# EAGLE design hbridge_DRV8432 (EAGLE 7.3.0)
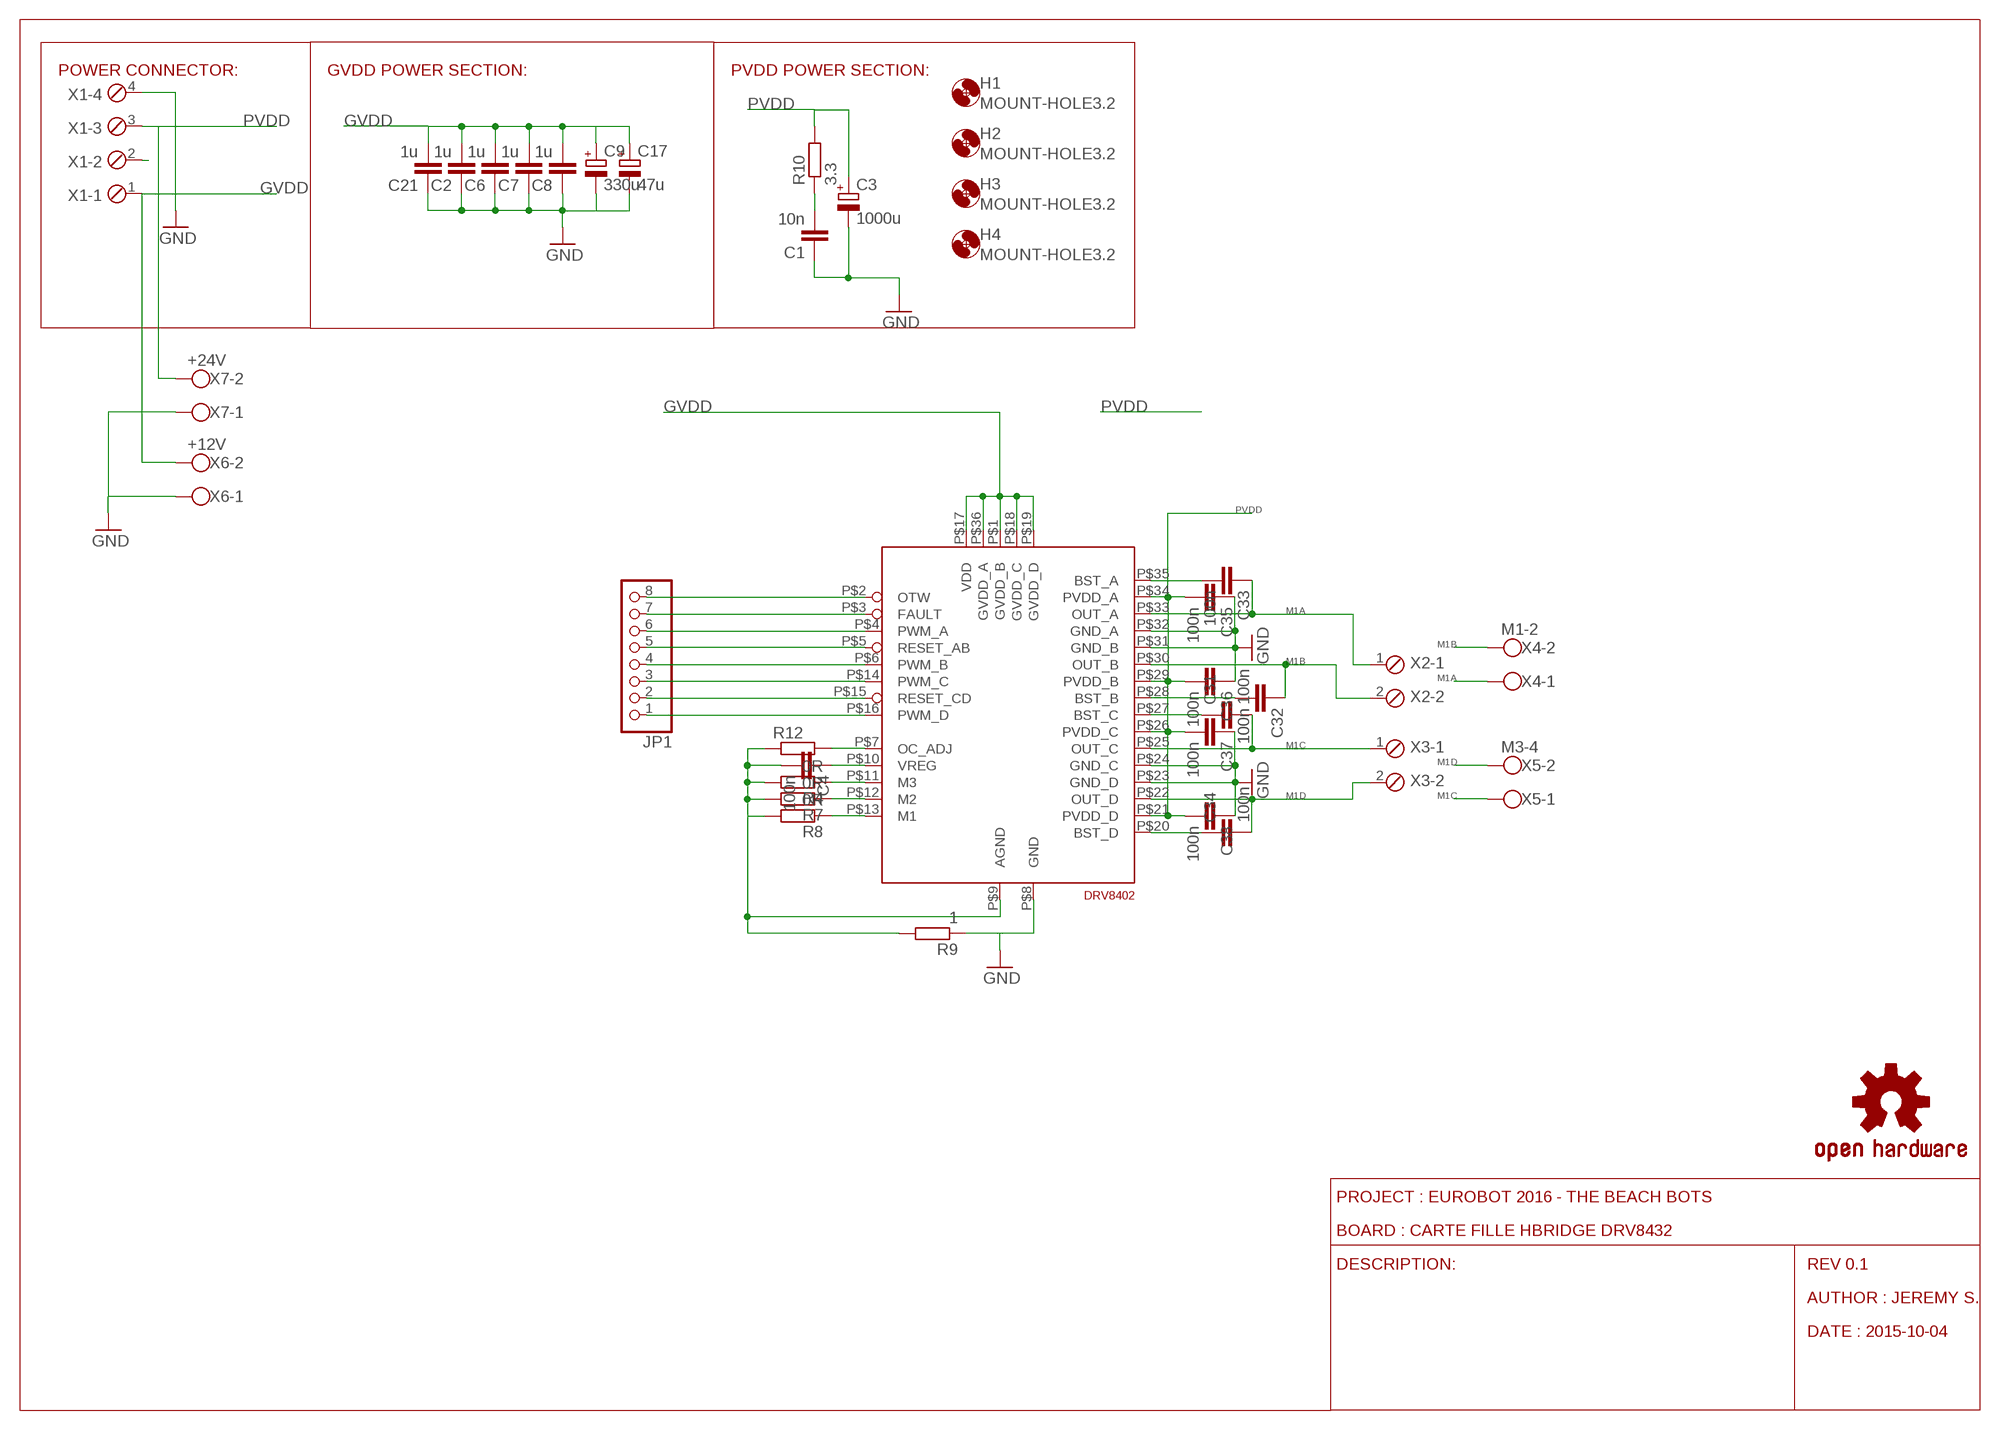
[diagram p0: schematic, sheet 1]

## Parts
C1  10n  C-EUC0805  [C0805]
C2  1u  C-EUC0805  [C0805]
C3  1000u  CPOL-EUE3.5-10  [E3,5-10]
C4  100n  C-EUC0603K  [C0603K]
C6  1u  C-EUC0805  [C0805]
C7  1u  C-EUC0805  [C0805]
C8  1u  C-EUC0805  [C0805]
C9  330u  CPOL-EUB/3528-21W  [B/3528-21W]
C17  47u  CPOL-EUB/3528-21W  [B/3528-21W]
C21  1u  C-EUC0805  [C0805]
C31  100n  C-EUC0805  [C0805]
C32  100n  C-EUC0805  [C0805]
C33  100n  C-EUC0805  [C0805]
C34  100n  C-EUC0805  [C0805]
C35  100n  C-EUC0603  [C0603]
C36  100n  C-EUC0603  [C0603]
C37  100n  C-EUC0603  [C0603]
C38  100n  C-EUC0603  [C0603]
H1  MOUNT-HOLE3.2  [3,2]
H2  MOUNT-HOLE3.2  [3,2]
H3  MOUNT-HOLE3.2  [3,2]
H4  MOUNT-HOLE3.2  [3,2]
IC1  DRV8402  [DRV8402]
JP1  PINHD-1X08_2.54  [1X08]
R4  0R  R-EU_R0603  [R0603]
R7  0R  R-EU_R0603  [R0603]
R8  0R  R-EU_R0603  [R0603]
R9  1  R-EU_R0603  [R0603]
R10  3.3  R-EU_R1206  [R1206]
R12  R-EU_R0603  [R0603]
U$1  OSHW-LOGOS  [OSHW-LOGO-S]
X1  MPT4  [4POL254]
X2  MPT2  [2POL254]
X3  MPT2  [2POL254]
X4  M1-2  W237-102  [W237-102]
X5  M3-4  W237-102  [W237-102]
X6  +12V  W237-102  [W237-102]
X7  +24V  W237-102  [W237-102]

## Nets
GND: C1.1 C2.1 C3.- C6.1 C7.1 C8.1 C9.- C17.- C21.1 C35.1 C36.1 C37.1 C38.1 IC1.P$8(GND) IC1.P$23(GND_D) IC1.P$24(GND_C) IC1.P$31(GND_B) IC1.P$32(GND_A) R9.1 X1.4 X6.1 X7.1
GVDD: C2.2 C6.2 C7.2 C8.2 C9.+ C17.+ C21.2 IC1.P$1(GVDD_B) IC1.P$17(VDD) IC1.P$18(GVDD_C) IC1.P$19(GVDD_D) IC1.P$36(GVDD_A) X1.1 X6.2
M1A: C33.1 IC1.P$33(OUT_A) X2.1 X4.1
M1B: C32.1 IC1.P$30(OUT_B) X2.2 X4.2
M1C: C31.2 IC1.P$25(OUT_C) X3.1 X5.1
M1D: C34.2 IC1.P$22(OUT_D) X3.2 X5.2
N$1: IC1.P$2(OTW) JP1.8
N$3: IC1.P$13(M1) R8.1
N$4: IC1.P$12(M2) R7.1
N$5: IC1.P$11(M3) R4.1
N$6: IC1.P$3(FAULT) JP1.7
N$8: IC1.P$4(PWM_A) JP1.6
N$9: C4.2 IC1.P$9(AGND) R4.2 R7.2 R8.2 R9.2 R12.1
N$10: IC1.P$7(OC_ADJ) R12.2
N$11: C4.1 IC1.P$10(VREG)
N$12: X1.2
N$13: C1.2 R10.1
N$16: IC1.P$5(RESET_AB) JP1.5
N$17: IC1.P$6(PWM_B) JP1.4
N$18: IC1.P$14(PWM_C) JP1.3
N$19: IC1.P$15(RESET_CD) JP1.2
N$20: IC1.P$16(PWM_D) JP1.1
N$25: C33.2 IC1.P$35(BST_A)
N$26: C32.2 IC1.P$28(BST_B)
N$27: C31.1 IC1.P$27(BST_C)
N$28: C34.1 IC1.P$20(BST_D)
PVDD: C3.+ C35.2 C36.2 C37.2 C38.2 IC1.P$21(PVDD_D) IC1.P$26(PVDD_C) IC1.P$29(PVDD_B) IC1.P$34(PVDD_A) R10.2 X1.3 X7.2

## Notes on the sheet
- POWER CONNECTOR: | GVDD POWER SECTION: | PVDD POWER SECTION:
- PROJECT : EUROBOT 2016 - THE BEACH BOTS
- BOARD : CARTE FILLE HBRIDGE DRV8432
- DESCRIPTION: | REV 0.1
- AUTHOR : JEREMY S.
- DATE : 2015-10-04

## Library data of the parts
C1 C2 C4 C6-C8 C21 C31-C38 = rcl:C-EU: CAPACITOR, European symbol
C3 C9 C17 = rcl:CPOL-EU: POLARIZED CAPACITOR, European symbol
H1-H4 = holes:MOUNT-HOLE: MOUNTING HOLE with drill center marker
IC1 = etienne:DRV8402
JP1 = pinhead-2:PINHD-1X08: PIN HEADER
R4 R7 R8 = resistor:R-EU_: RESISTOR, European symbol
R9 R10 R12 = rcl:R-EU_: RESISTOR, European symbol
U$1 = SparkFun-Aesthetics:OSHW-LOGO: Open Source Hardware Logo This logo indicates the piece of hardware it is found on incorporates a OSHW license and/or adheres to the definition of open source hardware found here: http://freedomdefined.org/OSHW
X1 = con-phoenix-254:MPT4: PHOENIX CONNECTOR; OC_FARNELL: unknown; OC_NEWARK: unknown
X2 X3 = con-phoenix-254:MPT2: PHOENIX CONNECTOR; OC_FARNELL: unknown; OC_NEWARK: unknown
X4-X7 = con-wago-500:W237-102: WAGO SCREW CLAMP

## Board
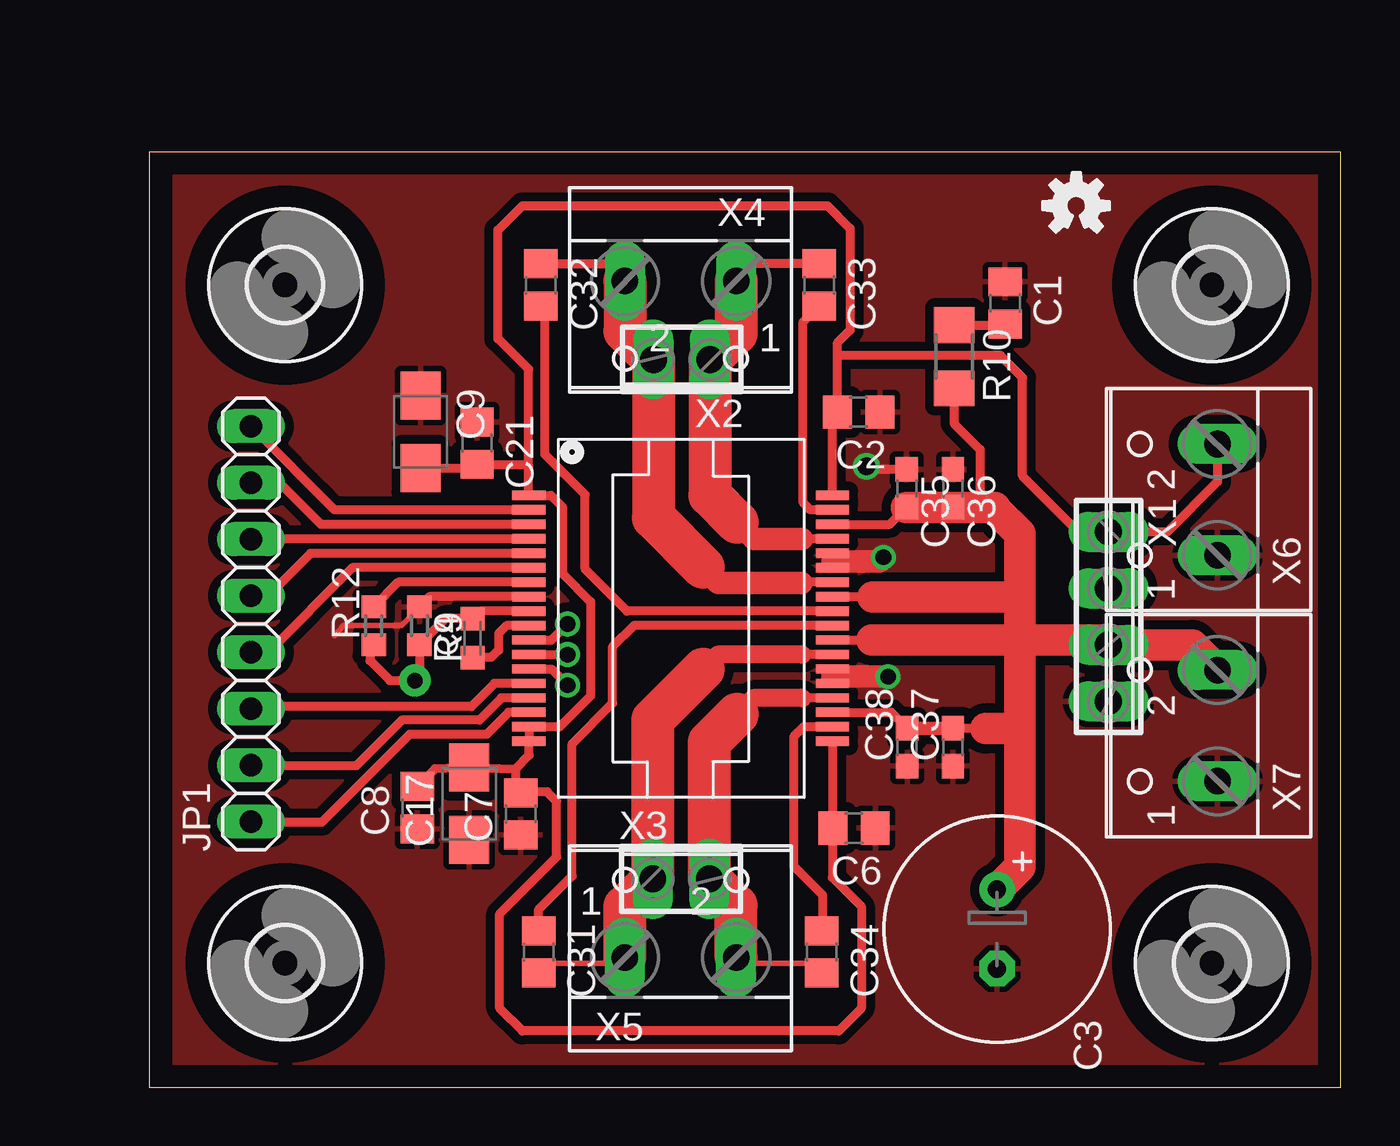
[diagram p1: board, top side]
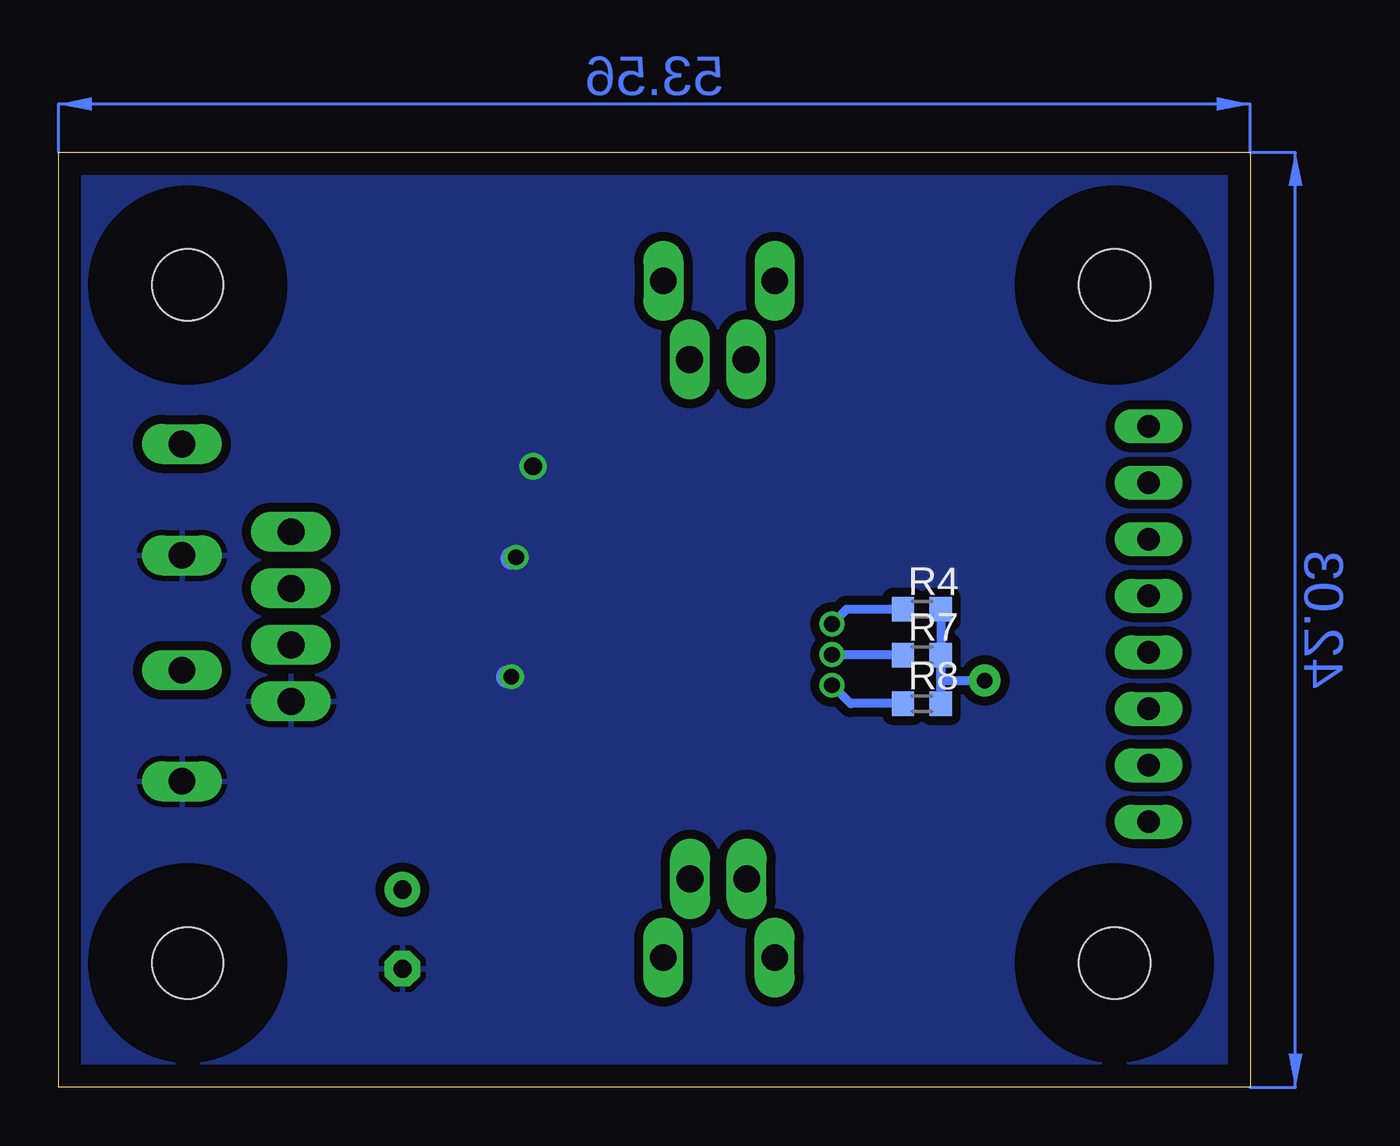
[diagram p2: board, bottom side, seen from below]

Size 53.56 x 42.03 mm. Coordinates in mm from the lower left corner, seen from the top.
Outline: 0,0 53.56,0 53.56,42.03 0,42.03 0,0
Copper layers (1*16): Top 0.035mm / dielectric 1.5mm / Bottom 0.035mm
Design rules "default": minimum track width 10mil, minimum drill 24mil, track to track 8mil, track to pad 8mil, pad to pad 8mil, via to via 8mil, smd to smd 8mil, copper to edge 40mil, drill to drill 8mil, minimum pad ring 10mil, minimum via ring 8mil, stop-mask expansion 4mil, vias tented up to drill 0mil, thermal gap 10mil

### Footprints (pad centres in the part's own frame; a part is rotated, then mirrored left to right if it is on the bottom)
C0805 = smd 1.3 x 1.5: 1 -0.95,0; 2 0.95,0
E3,5-10 = drill 0.813 pad 1.6: + -1.778,0 | drill 0.813 pad 1.6 octagon: - 1.778,0
C0603K = smd 1.05 x 1.08: 1 -0.875,0; 2 0.875,0
B/3528-21W = smd 2.15 x 1.8: + 1.625,0; - -1.625,0
C0603 = smd 1.1 x 1: 1 -0.85,0; 2 0.85,0
3,2 = hole 3.2: 0,0
DRV8402 = smd 0.42 x 1.5: P$1 -5.525,-6.825; P$2 -4.875,-6.825; P$3 -4.225,-6.825; P$4 -3.575,-6.825; P$5 -2.925,-6.825; P$6 -2.275,-6.825; P$7 -1.625,-6.825; P$8 -0.975,-6.825; P$9 -0.325,-6.825; P$10 0.325,-6.825; P$11 0.975,-6.825; P$12 1.625,-6.825; P$13 2.275,-6.825; P$14 2.925,-6.825; P$15 3.575,-6.825; P$16 4.225,-6.825; P$17 4.875,-6.825; P$18 5.525,-6.825; P$19 5.525,6.825; P$20 4.875,6.825; P$21 4.225,6.825; P$22 3.575,6.825; P$23 2.925,6.825; P$24 2.275,6.825; P$25 1.625,6.825; P$26 0.975,6.825; P$27 0.325,6.825; P$28 -0.325,6.825; P$29 -0.975,6.825; P$30 -1.625,6.825; P$31 -2.275,6.825; P$32 -2.925,6.825; P$33 -3.575,6.825; P$34 -4.225,6.825; P$35 -4.875,6.825; P$36 -5.525,6.825
1X08 = drill 1.016 long: 1 -8.89,0; 2 -6.35,0; 3 -3.81,0; 4 -1.27,0; 5 1.27,0; 6 3.81,0; 7 6.35,0; 8 8.89,0
R0603 = smd 1 x 1.1: 1 -0.85,0; 2 0.85,0
R1206 = smd 1.6 x 1.803: 1 -1.422,0; 2 1.422,0
4POL254 = drill 1.2 long: 1 -3.81,0; 2 -1.27,0; 3 1.27,0; 4 3.81,0
2POL254 = drill 1.2 long: 1 -1.27,0; 2 1.27,0
W237-102 = drill 1.194 long: 1 -2.5,-1.27; 2 2.5,-1.27

### Placement (x,y rotation side)
C1  38.46,35.26 270 top
C2  31.88,30.35 180 top
C3  38.1,7.11 270 top
C4  14.53,20.19 90 top
C6  31.67,11.66 180 top
C7  16.69,12.29 90 top
C8  12.04,12.57 90 top
C9  12.19,29.46 270 top
C17  14.38,12.75 90 top
C21  14.73,28.96 270 top
C31  17.5,6.1 270 top
C32  17.6,36.07 270 top
C33  30.1,36.07 270 top
C34  30.23,6.1 270 top
C35  34.04,26.92 270 top
C36  36.12,26.92 270 top
C37  36.12,15.29 90 top
C38  34.06,15.29 90 top
H1  6.1,5.59 0 top
H2  47.75,5.59 0 top
H3  6.1,36.07 0 top
H4  47.75,36.07 0 top
IC1  23.88,21.08 270 top
JP1  4.57,20.83 90 top
R4  14.76,21.49 0 bottom
R7  14.76,19.43 0 bottom
R8  14.76,17.25 0 bottom
R9  12.14,20.75 270 top
R10  36.17,32.84 270 top
R12  10.08,20.75 90 top
U$1  41.66,39.62 0 top
X1  43.1,21.16 270 top
X2  23.93,32.72 180 top
X3  23.9,9.37 0 top
X4  23.88,34.98 180 top
X5  23.88,7.11 0 top
X6  46.74,26.42 90 top
X7  46.74,16.26 90 top

### Tracks (layer width: path | path; a pad name or v marks a point on that pad's centre or on a via)
GND  (via drill 0.7 pad 1.02, 0.8 pad 1.02)
  Top 0.254: 12.15,21.55 11.33,20.75 8.74,20.75 8.33,20.32
  Top 0.305: 12.15,21.59 12.15,21.55 11.9,21.55
  Top 0.406: IC1.P$8 12.6,22.06 R9.1 | IC1.P$23 IC1.P$24 30.7,18.47 30.71,18.47 | IC1.P$31 IC1.P$32 30.7,23.66 30.71,23.65 | C35.1 32.58,27.77 v32.23,27.91
  Top 1.016: 30.71,18.47 v33.2,18.47 | 30.71,23.65 32.82,23.65 v33,23.82
  Bottom 0.406: v32.23,27.91 32.23,28.12
  Bottom 1.016: v33.2,18.47 33.38,18.47 33.4,18.44 | v33,23.82 33.15,23.82 33.2,23.77
  pour Bottom (isolate 0.406): 1.02,42.16 53.85,42.16 53.85,32.51 53.85,0 1.02,0
  pour Top (isolate 0.406): 1.02,42.16 1.02,0 53.85,0 53.85,42.16
GVDD
  Top 0.406: 16.46,14.32 C17.+ 12.84,14.32 C8.2 | 16.46,14.32 17.07,14.93 17.07,15.57 | IC1.P$17 17.07,16.19 17.07,15.57 | 16.46,14.32 16.46,13.68 C7.2 16.73,13.28 17.88,13.28 18.31,12.85 18.31,10.36 15.75,7.8 15.75,3.56 16.76,2.54 30.99,2.54 32,3.56 32,8.13 30.7,9.43 30.7,11.68 | 17.05,27.94 IC1.P$1 18.05,26.61 18.57,26.09 18.57,23.09 19.84,21.82 19.84,17.6 18.44,16.2 IC1.P$17 | 17.05,27.94 17.05,32.28 15.67,33.66 15.67,38.53 16.76,39.62 30.48,39.62 31.5,38.61 31.5,34.04 30.93,33.47 30.93,33.02 | IC1.P$36 30.7,30.07 C2.2 30.93,33.02 | 17.05,27.94 16.98,28.01 C21.2 14.56,27.84 C9.+ | IC1.P$19 30.7,11.68 | 30.7,11.68 C6.2 | 30.93,33.02 31.05,32.89 38.25,32.89 39.24,31.9 39.24,27.48 41.76,24.97 X1.1 45.75,24.97 48.01,27.23 X6.2 | IC1.P$17 | 17.07,15.57 IC1.P$18
M1A
  Top 0.406: C33.1 27.15,37.02 X4.1 | IC1.P$33 29.34,24.66 29.34,24.64
  Top 0.61: 28.96,24.64 29.03,24.61 29.01,24.59
  Top 1.016: 29.34,24.64 28.96,24.64 27.18,24.64 26.42,25.4
  Top 1.93: X4.1 26.38,33.89 X2.1 25.2,26.62 26.42,25.4
M1B
  Top 0.406: C32.1 20.6,37.02 X4.2 | 28.98,22.71 29.31,22.68 | IC1.P$30 28.96,22.71 28.96,22.68
  Top 1.016: 29.31,22.68 28.96,22.68 25.58,22.68 24.89,23.37
  Top 1.93: X4.2 21.38,34 X2.2 22.66,25.6 24.89,23.37
M1C
  Top 0.254: 20.68,5.15 21.34,5.15 21.34,5.59 17.5,5.59 C31.2
  Top 0.406: 20.68,5.15 X5.1 | IC1.P$25 28.98,19.46 29.34,19.46
  Top 0.813: 29.34,19.46 25.55,19.46 24.89,18.8
  Top 1.93: X5.1 21.38,8.12 X3.1 22.63,16.54 24.89,18.8
M1D
  Top 0.254: 27.07,5.15 26.42,5.15 26.42,5.59 30.23,5.59 C34.2
  Top 0.406: 27.07,5.15 X5.2 | IC1.P$22 28.99,17.51 29.34,17.5
  Top 0.813: 29.34,17.5 27.15,17.5 26.42,16.76
  Top 1.93: X5.2 26.38,8.17 X3.2 25.17,15.52 26.42,16.76
N$1
  Top 0.406: IC1.P$2 8.33,25.96 JP1.8
N$3  (via drill 0.7 pad 0.41)
  Top 0.406: IC1.P$13 18.07,18.81 v18.8,18.09
  Bottom 0.406: R8.1 17.96,17.25 v18.8,18.09
N$4  (via drill 0.7 pad 0.41)
  Top 0.406: IC1.P$12 18.82,19.46 v18.8,19.46
  Bottom 0.406: R7.1 18.77,19.43 v18.8,19.46
N$5  (via drill 0.7 pad 0.41)
  Top 0.406: IC1.P$11 18.07,20.11 v18.8,20.83
  Bottom 0.406: R4.1 18.14,21.49 v18.8,20.83
N$6
  Top 0.406: JP1.7 5.84,27.18 7.71,25.31 IC1.P$3
N$8
  Top 0.406: IC1.P$4 4.59,24.66 JP1.6
N$9  (via drill 0.7 pad 1.42)
  Top 0.406: R12.1 9.92,19.9 9.92,19.19 10.82,18.29 v11.94,18.29 12.14,18.49 R9.2 13.31,21.07 C4.2 14.87,21.41 IC1.P$9
  Bottom 0.406: R8.2 13.91,18.29 | 13.91,18.29 R7.2 R4.2 13.91,18.48 | 13.91,18.29 v11.94,18.29
N$10
  Top 0.406: IC1.P$7 11.19,22.71 R12.2
N$11
  Top 0.406: IC1.P$10 16.06,20.76 15.7,20.4 15.7,19.66 15.37,19.33 14.54,19.33 C4.1
N$13
  Top 0.406: R10.1 38.98,34.26 C1.2
N$16
  Top 0.406: JP1.5 5.33,22.1 7.24,24.01 IC1.P$5
N$17
  Top 0.406: JP1.4 5.33,19.56 9.13,23.36 IC1.P$6
N$18
  Top 0.406: IC1.P$14 15.52,18.16 14.48,17.12 4.67,17.12 JP1.3 4.6,16.99
N$19
  Top 0.406: IC1.P$15 15.83,17.51 14.83,16.51 11.35,16.51 9.3,14.45 4.6,14.45 JP1.2
N$20
  Top 0.406: IC1.P$16 16.15,16.86 15.16,15.88 11.71,15.88 7.75,11.91 4.6,11.91 JP1.1
N$25
  Top 0.406: IC1.P$35 29.72,25.96 29.39,26.29 29.39,34.41 C33.2
N$26
  Top 0.406: 17.22,35.07 C32.2 17.78,34.61 17.78,28.45 18.29,27.94 18.59,27.64 19.58,26.64 19.58,23.29 21.47,21.41 IC1.P$28
N$27
  Top 0.406: IC1.P$27 21.77,20.76 20.83,19.81 20.83,17.27 19,15.44 19,9.5 17.5,8 C31.1
N$28
  Top 0.406: IC1.P$20 29.41,16.21 28.96,15.75 28.96,9.96 30.25,8.66 30.25,7.07 C34.1
PVDD
  Top 0.406: IC1.P$34 33.27,25.31 C35.2 C36.2 37.5,26.07 37.34,26.24 37.34,28.68 36.17,29.85 R10.2 | IC1.P$21 33.34,16.86 C38.2 | IC1.P$26 32.49,20.11 32.49,20.09 | IC1.P$29 32.51,22.06 32.51,22.05 | 37.59,16.13 36.12,16.13 C37.2
  Top 0.61: C37.2 C38.2 | R10.2
  Top 1.422: 32.49,20.11 39.12,20.11 | 32.51,22.05 39.12,22.05 | 39.12,20.11 39.12,22.05 | 39.12,22.05 39.12,24.89 38.01,26 38.01,26.07 C35.2 | 39.12,20.11 39.12,16.14 | 39.12,16.14 39.12,9.91 C3.+ | 39.12,20.11 42.89,20.11 X1.3 46.87,19.89 X7.2 | 39.12,16.14 37.59,16.14 37.59,16.13
(copper drawn outside any net)
  shapes: Bottom area x2